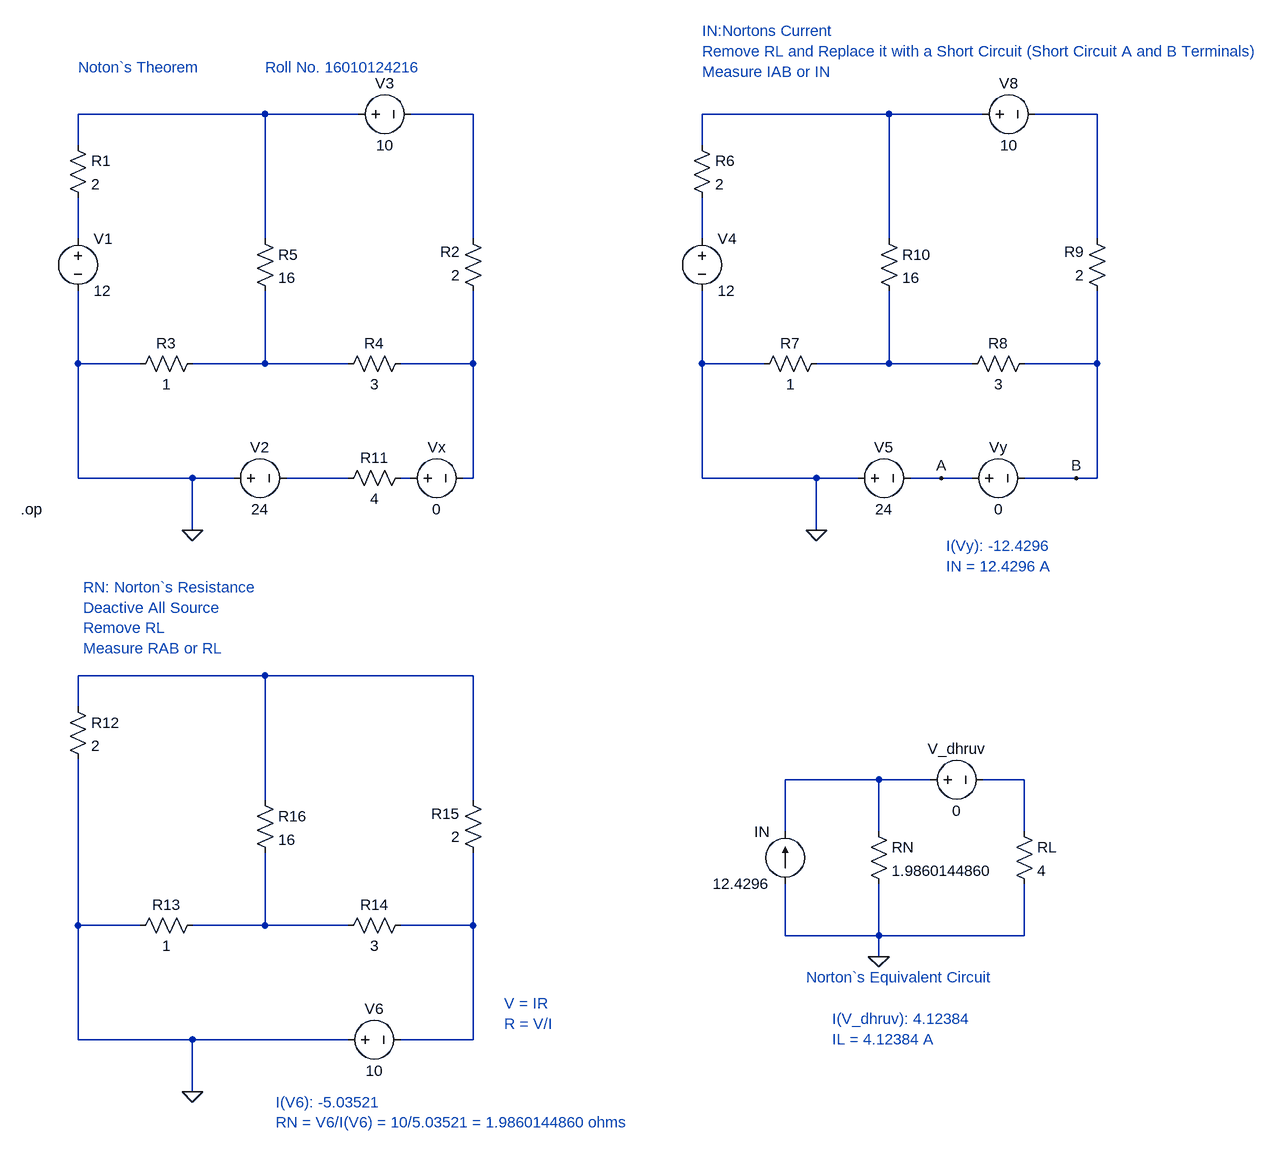
[diagram p0: schematic EEEE IA-1.asc]
EEEE IA-1.asc, the LTspice schematic file:
Version 4
SHEET 1 2000 1516
WIRE 400 -48 112 -48
WIRE 544 -48 400 -48
WIRE 720 -48 624 -48
WIRE 1360 -48 1072 -48
WIRE 1504 -48 1360 -48
WIRE 1680 -48 1584 -48
WIRE 112 0 112 -48
WIRE 1072 0 1072 -48
WIRE 112 144 112 80
WIRE 400 144 400 -48
WIRE 720 144 720 -48
WIRE 1072 144 1072 80
WIRE 1360 144 1360 -48
WIRE 1680 144 1680 -48
WIRE 112 336 112 224
WIRE 208 336 112 336
WIRE 400 336 400 224
WIRE 400 336 288 336
WIRE 528 336 400 336
WIRE 720 336 720 224
WIRE 720 336 608 336
WIRE 1072 336 1072 224
WIRE 1168 336 1072 336
WIRE 1360 336 1360 224
WIRE 1360 336 1248 336
WIRE 1488 336 1360 336
WIRE 1680 336 1680 224
WIRE 1680 336 1568 336
WIRE 112 512 112 336
WIRE 288 512 112 512
WIRE 352 512 288 512
WIRE 528 512 432 512
WIRE 624 512 608 512
WIRE 720 512 720 336
WIRE 720 512 704 512
WIRE 1072 512 1072 336
WIRE 1248 512 1072 512
WIRE 1312 512 1248 512
WIRE 1440 512 1392 512
WIRE 1488 512 1440 512
WIRE 1648 512 1568 512
WIRE 1680 512 1680 336
WIRE 1680 512 1648 512
WIRE 288 592 288 512
WIRE 1248 592 1248 512
WIRE 400 816 112 816
WIRE 720 816 400 816
WIRE 112 864 112 816
WIRE 1344 976 1200 976
WIRE 1424 976 1344 976
WIRE 1568 976 1504 976
WIRE 400 1008 400 816
WIRE 720 1008 720 816
WIRE 1200 1056 1200 976
WIRE 1344 1056 1344 976
WIRE 1568 1056 1568 976
WIRE 112 1200 112 944
WIRE 208 1200 112 1200
WIRE 400 1200 400 1088
WIRE 400 1200 288 1200
WIRE 528 1200 400 1200
WIRE 720 1200 720 1088
WIRE 720 1200 608 1200
WIRE 1200 1216 1200 1136
WIRE 1344 1216 1344 1136
WIRE 1344 1216 1200 1216
WIRE 1568 1216 1568 1136
WIRE 1568 1216 1344 1216
WIRE 1344 1248 1344 1216
WIRE 112 1376 112 1200
WIRE 288 1376 112 1376
WIRE 528 1376 288 1376
WIRE 720 1376 720 1200
WIRE 720 1376 608 1376
WIRE 288 1456 288 1376
FLAG 288 592 0
FLAG 1248 592 0
FLAG 1440 512 A
FLAG 1648 512 B
FLAG 288 1456 0
FLAG 1344 1248 0
SYMBOL voltage 112 128 R0
WINDOW 123 0 0 Left 0
WINDOW 39 0 0 Left 0
SYMATTR InstName V1
SYMATTR Value 12
SYMBOL res 96 -16 R0
SYMATTR InstName R1
SYMATTR Value 2
SYMBOL res 304 320 R90
WINDOW 0 0 56 VBottom 2
WINDOW 3 32 56 VTop 2
SYMATTR InstName R3
SYMATTR Value 1
SYMBOL res 624 320 R90
WINDOW 0 0 56 VBottom 2
WINDOW 3 32 56 VTop 2
SYMATTR InstName R4
SYMATTR Value 3
SYMBOL res 736 240 R180
WINDOW 0 36 76 Left 2
WINDOW 3 36 40 Left 2
SYMATTR InstName R2
SYMATTR Value 2
SYMBOL voltage 336 512 R270
WINDOW 0 32 56 VTop 2
WINDOW 3 -32 56 VBottom 2
WINDOW 123 0 0 Left 0
WINDOW 39 0 0 Left 0
SYMATTR InstName V2
SYMATTR Value 24
SYMBOL voltage 528 -48 R270
WINDOW 0 32 56 VTop 2
WINDOW 3 -32 56 VBottom 2
SYMATTR InstName V3
SYMATTR Value 10
SYMBOL res 384 128 R0
SYMATTR InstName R5
SYMATTR Value 16
SYMBOL voltage 1072 128 R0
WINDOW 123 0 0 Left 0
WINDOW 39 0 0 Left 0
SYMATTR InstName V4
SYMATTR Value 12
SYMBOL res 1056 -16 R0
SYMATTR InstName R6
SYMATTR Value 2
SYMBOL res 1264 320 R90
WINDOW 0 0 56 VBottom 2
WINDOW 3 32 56 VTop 2
SYMATTR InstName R7
SYMATTR Value 1
SYMBOL res 1584 320 R90
WINDOW 0 0 56 VBottom 2
WINDOW 3 32 56 VTop 2
SYMATTR InstName R8
SYMATTR Value 3
SYMBOL res 1696 240 R180
WINDOW 0 36 76 Left 2
WINDOW 3 36 40 Left 2
SYMATTR InstName R9
SYMATTR Value 2
SYMBOL voltage 1296 512 R270
WINDOW 0 32 56 VTop 2
WINDOW 3 -32 56 VBottom 2
WINDOW 123 0 0 Left 0
WINDOW 39 0 0 Left 0
SYMATTR InstName V5
SYMATTR Value 24
SYMBOL voltage 1488 -48 R270
WINDOW 0 32 56 VTop 2
WINDOW 3 -32 56 VBottom 2
SYMATTR InstName V8
SYMATTR Value 10
SYMBOL res 1344 128 R0
SYMATTR InstName R10
SYMATTR Value 16
SYMBOL voltage 1472 512 R270
WINDOW 0 32 56 VTop 2
WINDOW 3 -32 56 VBottom 2
WINDOW 123 0 0 Left 0
WINDOW 39 0 0 Left 0
SYMATTR InstName Vy
SYMATTR Value 0
SYMBOL res 624 496 R90
WINDOW 0 0 56 VBottom 2
WINDOW 3 32 56 VTop 2
SYMATTR InstName R11
SYMATTR Value 4
SYMBOL res 96 848 R0
SYMATTR InstName R12
SYMATTR Value 2
SYMBOL res 304 1184 R90
WINDOW 0 0 56 VBottom 2
WINDOW 3 32 56 VTop 2
SYMATTR InstName R13
SYMATTR Value 1
SYMBOL res 624 1184 R90
WINDOW 0 0 56 VBottom 2
WINDOW 3 32 56 VTop 2
SYMATTR InstName R14
SYMATTR Value 3
SYMBOL res 736 1104 R180
WINDOW 0 36 76 Left 2
WINDOW 3 36 40 Left 2
SYMATTR InstName R15
SYMATTR Value 2
SYMBOL res 384 992 R0
SYMATTR InstName R16
SYMATTR Value 16
SYMBOL voltage 512 1376 R270
WINDOW 0 32 56 VTop 2
WINDOW 3 -32 56 VBottom 2
SYMATTR InstName V6
SYMATTR Value 10
SYMBOL voltage 608 512 R270
WINDOW 0 32 56 VTop 2
WINDOW 3 -32 56 VBottom 2
SYMATTR InstName Vx
SYMATTR Value 0
SYMBOL res 1328 1040 R0
SYMATTR InstName RN
SYMATTR Value 1.9860144860
SYMBOL res 1552 1040 R0
SYMATTR InstName RL
SYMATTR Value 4
SYMBOL voltage 1408 976 R270
WINDOW 0 32 56 VTop 2
WINDOW 3 -32 56 VBottom 2
SYMATTR InstName V_dhruv
SYMATTR Value 0
SYMBOL current 1200 1136 R180
WINDOW 0 24 80 Left 2
WINDOW 3 24 0 Left 2
WINDOW 123 0 0 Left 0
WINDOW 39 0 0 Left 0
SYMATTR InstName IN
SYMATTR Value 12.4296
TEXT 24 560 Left 2 !.op
TEXT 112 -120 Left 2 ;Noton`s Theorem
TEXT 1072 -176 Left 2 ;IN:Nortons Current\nRemove RL and Replace it with a Short Circuit (Short Circuit A and B Terminals)\nMeasure IAB or IN
TEXT 120 680 Left 2 ;RN: Norton`s Resistance\nDeactive All Source\nRemove RL\nMeasure RAB or RL
TEXT 768 1320 Left 2 ;V = IR\nR = V/I
TEXT 416 1472 Left 2 ;I(V6): -5.03521\nRN = V6/I(V6) = 10/5.03521 = 1.9860144860 ohms
TEXT 1232 1280 Left 2 ;Norton`s Equivalent Circuit
TEXT 1448 616 Left 2 ;I(Vy): -12.4296\nIN = 12.4296 A
TEXT 1272 1344 Left 2 ;I(V_dhruv): 4.12384\nIL = 4.12384 A
TEXT 400 -120 Left 2 ;Roll No. 16010124216

The netlist it stands for:
* EEEE IA-1.asc
V1 N005 0 12
R1 N001 N005 2
R3 N007 0 1
R4 N008 N007 3
R2 N008 N002 2
V2 0 N010 24
V3 N001 N002 10
R5 N001 N007 16
V4 N006 0 12
R6 N003 N006 2
R7 N009 0 1
R8 B N009 3
R9 B N004 2
V5 0 A 24
V8 N003 N004 10
R10 N003 N009 16
Vy A B 0
R11 N011 N010 4
R12 N012 0 2
R13 N015 0 1
R14 N016 N015 3
R15 N016 N012 2
R16 N012 N015 16
V6 0 N016 10
Vx N011 N008 0
RN N013 0 1.9860144860
RL N014 0 4
V_dhruv N013 N014 0
IN 0 N013 12.4296
.op
* Noton`s Theorem
* IN:Nortons Current
* Remove RL and Replace it with a Short Circuit (Short Circuit A and B Terminals)
* Measure IAB or IN
* RN: Norton`s Resistance
* Deactive All Source
* Remove RL
* Measure RAB or RL
* V = IR
* R = V/I
* I(V6): -5.03521
* RN = V6/I(V6) = 10/5.03521 = 1.9860144860 ohms
* Norton`s Equivalent Circuit
* I(Vy): -12.4296
* IN = 12.4296 A
* I(V_dhruv): 4.12384
* IL = 4.12384 A
* Roll No. 16010124216
.backanno
.end